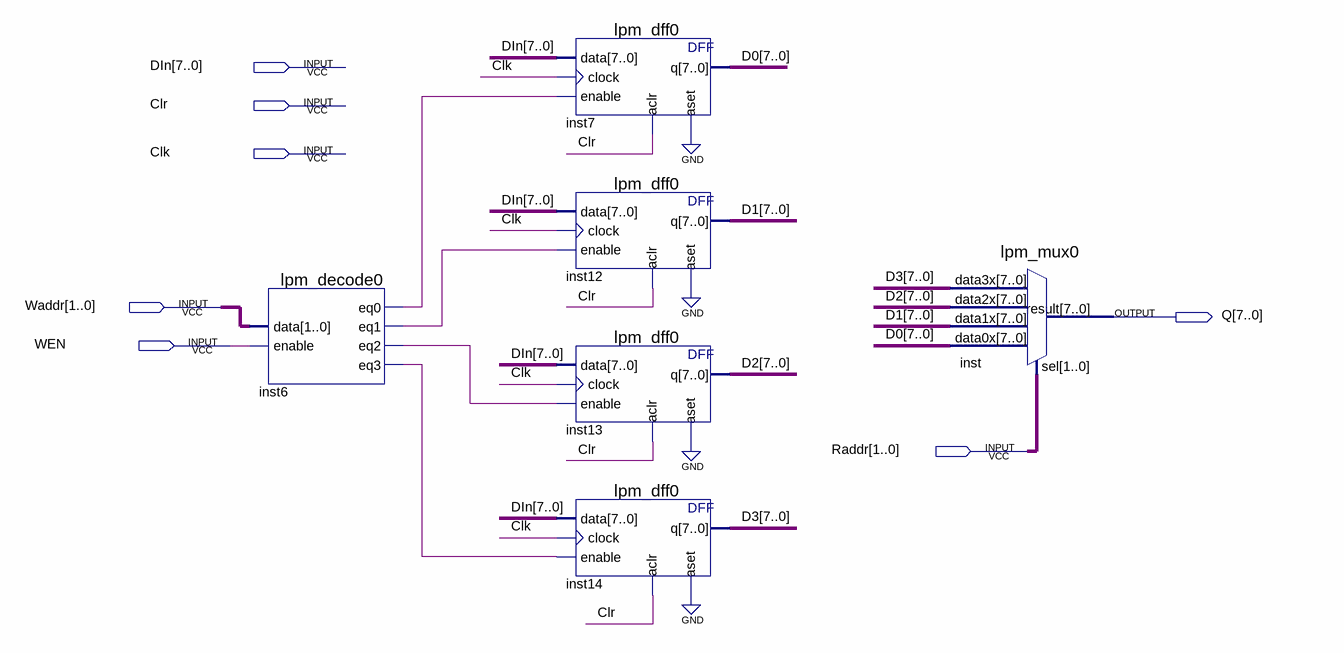
[diagram p0: schematic sheet]
// Quartus schematic regs48.bdf as structural Verilog: 6 symbols, 7 pins
module regs48 (
  input  [7:0] DIn,
  input  Clr,
  input  Clk,
  input  [1:0] Waddr,
  input  WEN,
  input  [1:0] Raddr,
  output [7:0] Q
);

  wire inst6_eq0, inst6_eq1, inst6_eq2, inst6_eq3;
  wire [7:0] D0, D1, D2, D3;

  lpm_decode0 inst6 (.data(Waddr), .enable(WEN), .eq0(inst6_eq0), .eq1(inst6_eq1), .eq2(inst6_eq2), .eq3(inst6_eq3));
  lpm_dff0 inst7 (.data(DIn), .clock(Clk), .enable(inst6_eq0), .aclr(Clr), .aset(1'b0), .q(D0));
  lpm_dff0 inst12 (.data(DIn), .clock(Clk), .enable(inst6_eq1), .aclr(Clr), .aset(1'b0), .q(D1));
  lpm_dff0 inst13 (.data(DIn), .clock(Clk), .enable(inst6_eq2), .aclr(Clr), .aset(1'b0), .q(D2));
  lpm_dff0 inst14 (.data(DIn), .clock(Clk), .enable(inst6_eq3), .aclr(Clr), .aset(1'b0), .q(D3));
  lpm_mux0 inst (.data3x(D3), .data2x(D2), .data1x(D1), .data0x(D0), .sel(Raddr), .result(Q));
endmodule
